# Altium schematic sheet IMU.SchDoc
size A4; SheetNumber: 2; SheetTotal: 6
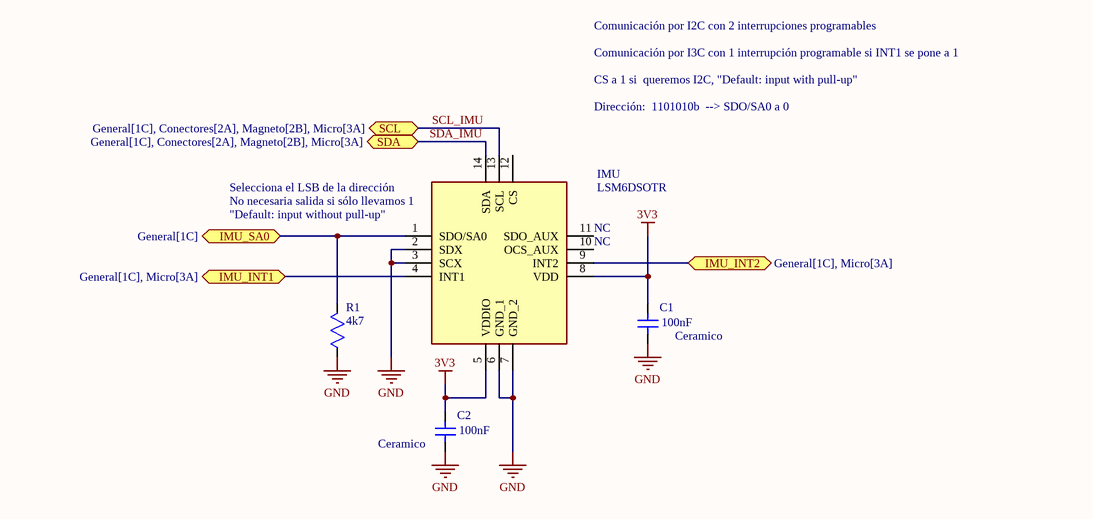
[diagram p0: IMU.SchDoc]

## Parts
C1  Valor: 100nF  [CAP SMD 0805]  (hidden comment: CAP_0805_100nF)
C2  Valor: 100nF  [CAP SMD 0805]  (hidden comment: CAP_0805_100nF)
IMU  LSM6DSOTR  [LGA-14(2.5X3X0.86)]
R1  Valor: 4k7  [RES SMD 0805]  (hidden comment: RES_0805_4k7)

## Ports
IMU_INT1 (bidir, see General[1C], Micro[3A]), IMU_INT2 (bidir, see General[1C], Micro[3A]), IMU_SA0 (bidir, see General[1C]), SCL (bidir, see General[1C], Conectores[2A], Magneto[2B], Micro[3A]), SDA (bidir, see General[1C], Conectores[2A], Magneto[2B], Micro[3A])

## Nets
3V3: C1.1 C2.1 IMU.5(VDDIO) IMU.8(VDD)
GND: C1.2 C2.2 IMU.2(SDX) IMU.3(SCX) IMU.6(GND_1) IMU.7(GND_2) R1.1
IMU_INT1: IMU.4(INT1) ; port IMU_INT1
IMU_INT2: IMU.9(INT2) ; port IMU_INT2
IMU_SA0: IMU.1(SDO/SA0) R1.2 ; port IMU_SA0
SCL_IMU: IMU.13(SCL) ; port SCL
SDA_IMU: IMU.14(SDA) ; port SDA

Not connected (* = marked no-connect by the designer): IMU 10(OCS_AUX) 11(SDO_AUX) 12(CS)

## Notes on the sheet
- Comunicación por I2C con 2 interrupciones programables
- Comunicación por I3C con 1 interrupción programable si INT1 se pone a 1
- CS a 1 si  queremos I2C, "Default: input with pull-up"
- Dirección:  1101010b  --> SDO/SA0 a 0
- (near IMU) No necesaria salida si sólo llevamos 1
- (near IMU) Selecciona el LSB de la dirección
- (near IMU) "Default: input without pull-up"
- (near IMU) NC
- (near C1) Ceramico
- (near C2) Ceramico

## Library data of the parts
C1 C2 = CMP-081-000008-1: Condensador 0805 100nF; Fabricante: -; Design Item ID: CAP_0805_100nF; ComponentLink1URL: -; Distribuidor: -; Source: ARUS2021.SchLib; RefDistribuidor: -; RefFabricante: -; ComponentLink2URL: -; ComponentLink1Description: Link-Compra; ComponentLink2Description: Datasheet
IMU = LSM6DSOTR: Accelerometer; Manufacturer_Name: STMicroelectronics; Datasheet Link: https://www.st.com/resource/en/datasheet/lsm6dso.pdf; Manufacturer_Part_Number: LSM6DSOTR; Mouser Part Number: 511-LSM6DSOTR; Mouser Price/Stock: https://www.mouser.co.uk/ProductDetail/STMicroelectronics/LSM6DSOTR?qs=lc2O%252BfHJPVbD197C5c7oNw%3D%3D; Arrow Part Number: LSM6DSOTR; Arrow Price/Stock: https://www.arrow.com/en/products/lsm6dsotr/stmicroelectronics?region=nac
R1 = CMP-088-000005-1: Resistencia 0805 4k7; RefDistribuidor: -; ComponentLink1Description: Link-Compra; Design Item ID: RES_0805_4k7; Fabricante: -; ComponentLink1URL: -; Source: ARUS2021.SchLib; ComponentLink2URL: -; RefFabricante: -; ComponentLink2Description: Datasheet; Distribuidor: -